# Altium schematic sheet Sheet1.SchDoc
size A4
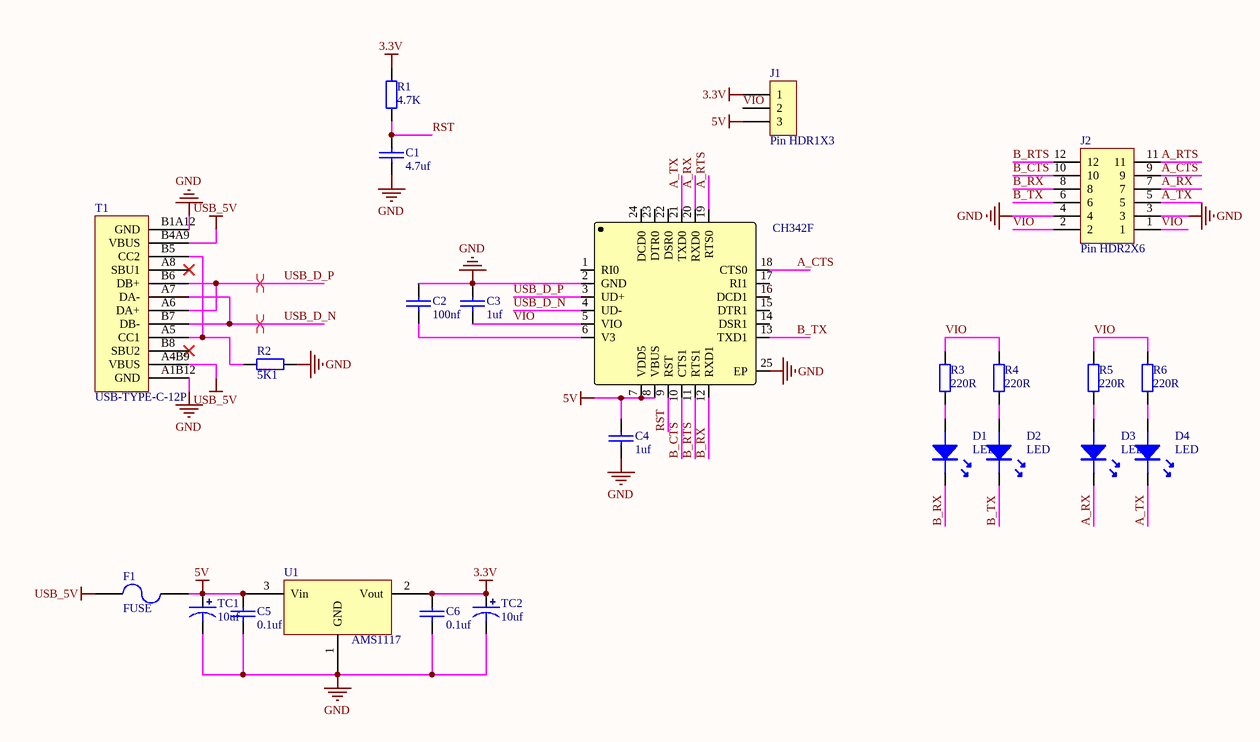
[diagram p0: Sheet1.SchDoc]

## Parts
*  CH342F  [QFN24-PAD 4X4]
C1  4.7uf  [0603C]
C2  100nf  [0603C]
C3  1uf  [0603C]
C4  1uf  [0603C]
C5  0.1uf  [0603C]
C6  0.1uf  [0603C]
D1  LED  [LED-0603B]
D2  LED  [LED-0603B]
D3  LED  [LED-0603B]
D4  LED  [LED-0603B]
F1  FUSE  [FUSE-1210]
J1  Pin HDR1X3  [Pin HDR1X3/2.54mm-S]
J2  Pin HDR2X6  [Pin HDR2X6/2.54mm-W]
R1  4.7K  [0603R]
R2  5K1  [0603R]
R3  220R  [0603R]
R4  220R  [0603R]
R5  220R  [0603R]
R6  220R  [0603R]
T1  USB-TYPE-C-12P  [type-c-12p]
TC1  10uf  [TAJ-A/3216]
TC2  10uf  [TAJ-A/3216]
U1  AMS1117  [SOT223]

## Nets
3.3V: C6.2 J1.1 R1.1 TC2.1 U1.2(Vout)
5V: *.7(VDD5) *.8(VBUS) C4.2 C5.2 F1.2 J1.3 TC1.1 U1.3(Vin)
GND: *.2(GND) *.25(EP) C1.2 C2.1 C3.1 C4.1 C5.1 C6.1 J2.3 J2.4 R2.1 T1.A1B12(GND) T1.B1A12(GND) TC1.2 TC2.2 U1.1(GND)
USB_5V: F1.1 T1.A4B9(VBUS) T1.B4A9(VBUS)
A_CTS: *.18(CTS0) J2.9
A_RTS: *.19(RTS0) J2.11
A_RX: *.20(RXD0) D3.K J2.7
A_TX: *.21(TXD0) D4.K J2.5
B_CTS: *.10(CTS1) J2.10
B_RTS: *.11(RTS1) J2.12
B_RX: *.12(RXD1) D1.K J2.8
B_TX: *.13(TXD1) D2.K J2.6
RST: *.9(RST) C1.1 R1.2
USB_D_N: *.4(UD-) T1.A7(DA-) T1.B7(DB-)
USB_D_P: *.3(UD+) T1.A6(DA+) T1.B6(DB+)
VIO: *.5(VIO) C3.2 J1.2 J2.1 J2.2 R3.1 R4.1 R5.1 R6.1
Net*_6: *.6(V3) C2.2
NetD1_A: D1.A R3.2
NetD2_A: D2.A R4.2
NetD3_A: D3.A R5.2
NetD4_A: D4.A R6.2
NetR2_2: R2.2 T1.A5(CC1) T1.B5(CC2)

Not connected (* = marked no-connect by the designer): * 1(RI0) 14(DSR1) 15(DTR1) 16(DCD1) 17(RI1) 22(DSR0) 23(DTR0) 24(DCD0); T1 A8(SBU1)* B8(SBU2)*

## Layout directives
differential pair: USB_D_N, USB_D_P

## Library data of the parts
C1-C6 = CAP: 无极性电容
R1-R6 = RES: 贴片电阻
TC1 TC2 = TCAP: 钽电容
U1 = AMS1117: 三端稳压芯片